# EAGLE design piezo-jfet-buffer-simple-4x (EAGLE 7.2.0)
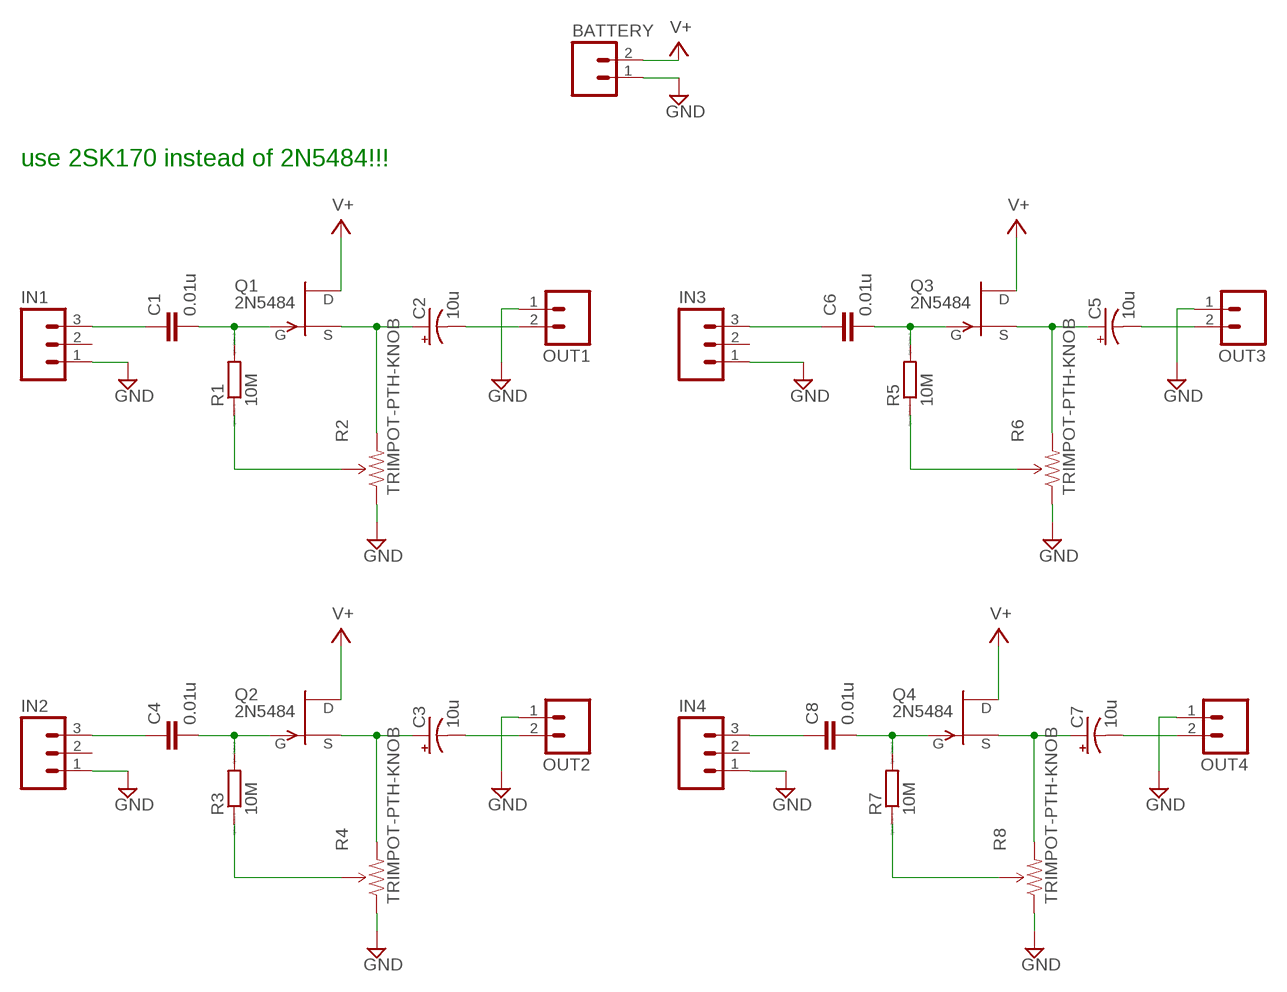
[diagram p0: schematic, sheet 1]

## Parts
BATTERY  M02PTH  [1X02]
C1  0.01u  C5/3  [C5B3]
C2  10u  CAP_POLPTH2  [CPOL-RADIAL-10UF-25V]
C3  10u  CAP_POLPTH2  [CPOL-RADIAL-10UF-25V]
C4  0.01u  C5/3  [C5B3]
C5  10u  CAP_POLPTH2  [CPOL-RADIAL-10UF-25V]
C6  0.01u  C5/3  [C5B3]
C7  10u  CAP_POLPTH2  [CPOL-RADIAL-10UF-25V]
C8  0.01u  C5/3  [C5B3]
IN1  M03LOCK  [1X03_LOCK]
IN2  M03LOCK  [1X03_LOCK]
IN3  M03LOCK  [1X03_LOCK]
IN4  M03LOCK  [1X03_LOCK]
OUT1  M02LOCK  [1X02_LOCK]
OUT2  M02LOCK  [1X02_LOCK]
OUT3  M02LOCK  [1X02_LOCK]
OUT4  M02LOCK  [1X02_LOCK]
Q1  2N5484  [TO92-]
Q2  2N5484  [TO92-]
Q3  2N5484  [TO92-]
Q4  2N5484  [TO92-]
R1  10M  R0204/7  [0204/7]
R2  TRIMPOT-PTH-KNOB  [3386U]
R3  10M  R0204/7  [0204/7]
R4  TRIMPOT-PTH-KNOB  [3386U]
R5  10M  R0204/7  [0204/7]
R6  TRIMPOT-PTH-KNOB  [3386U]
R7  10M  R0204/7  [0204/7]
R8  TRIMPOT-PTH-KNOB  [3386U]

## Nets
CH1: C2.2(-) OUT1.2
CH2: C3.2(-) OUT2.2
CH3: C5.2(-) OUT3.2
CH4: C7.2(-) OUT4.2
GND: BATTERY.1 IN1.1 IN2.1 IN3.1 IN4.1 OUT1.1 OUT2.1 OUT3.1 OUT4.1 R2.1(CCW) R4.1(CCW) R6.1(CCW) R8.1(CCW)
JFET-GATE: C1.2 Q1.1(G) R1.2
JFET-GATE1: C4.2 Q2.1(G) R3.2
JFET-GATE2: C6.2 Q3.1(G) R5.2
JFET-GATE3: C8.2 Q4.1(G) R7.2
JFET-SOURCE: C2.1(+) Q1.2(S) R2.3(CW)
JFET-SOURCE1: C3.1(+) Q2.2(S) R4.3(CW)
JFET-SOURCE2: C5.1(+) Q3.2(S) R6.3(CW)
JFET-SOURCE3: C7.1(+) Q4.2(S) R8.3(CW)
N$1: C1.1 IN1.3
N$2: C4.1 IN2.3
N$3: R1.1 R2.2(WIPER)
N$4: R3.1 R4.2(WIPER)
N$5: C6.1 IN3.3
N$6: R5.1 R6.2(WIPER)
N$7: C8.1 IN4.3
N$8: R7.1 R8.2(WIPER)
V+: BATTERY.2 Q1.3(D) Q2.3(D) Q3.3(D) Q4.3(D)
Unconnected: IN1.2 IN2.2 IN3.2 IN4.2

## Notes on the sheet
- use 2SK170 instead of 2N5484!!!

## Library data of the parts
BATTERY OUT1-OUT4 = SparkFun-Connectors:M02: Header 2 Standard 2-pin 0.1" header. Use with straight break away headers (SKU : PRT-00116), right angle break away headers (PRT-00553), swiss pins (PRT-00743), machine pins (PRT-00117), and female headers (PRT-00115). Molex polarized connector foot print use with SKU : PRT-08233 with associated crimp pins and housings.
C1 C4 C6 C8 = capacitor-wima:C: CAPACITOR naming: grid - package width
C2 C3 C5 C7 = SparkFun-Passives:CAP_POL: Capacitor Polarized These are standard SMD and PTH capacitors. Normally 10uF, 47uF, and 100uF in electrolytic and tantalum varieties. Always verify the external diameter of the through hole cap, it varies with capacity, voltage, and manufacturer. The EIA devices should be standard.
IN1-IN4 = SparkFun-Connectors:M03: Header 3 Standard 3-pin 0.1" header. Use with straight break away headers (SKU : PRT-00116), right angle break away headers (PRT-00553), swiss pins (PRT-00743), machine pins (PRT-00117), and female headers (PRT-00115). Molex polarized connector foot print use with SKU : PRT-08232 with associated crimp pins and housings.
Q1-Q4 = transistor-fet:?548*: N-Channel JFETs Source: VISHAY 2N5484.pdf Compatible: TO92 2N5245 J304 J305 U310 J308 J309 J310 TO72 2N4416 2N4416A 2N3823 2N4351 3N169 3N170 3N171 MFE3002 TO18 2N3796 2N3797 MFE825 Source: Motorola European Master Guide Pacge 3-59
R1 R3 R5 R7 = eagle-ltspice:R: RESISTOR, European symbol; SPICEMODEL: NONE; SPICEPREFIX: R
R2 R4 R6 R8 = SparkFun-Electromechanical:TRIMPOT: Various small potentiometers for "set-and-forget" applications

## Board
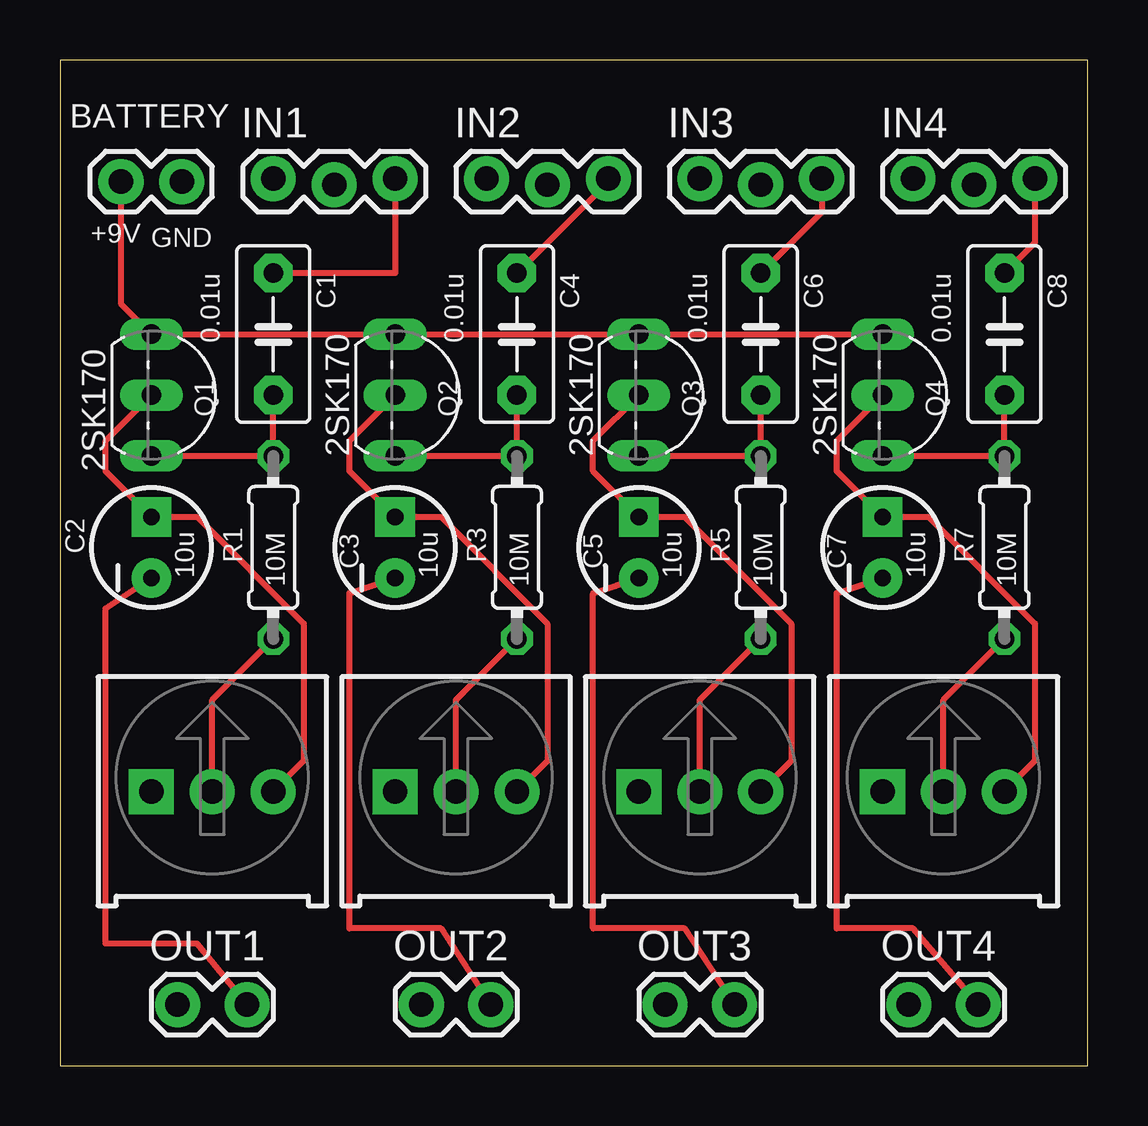
[diagram p1: board, top side]
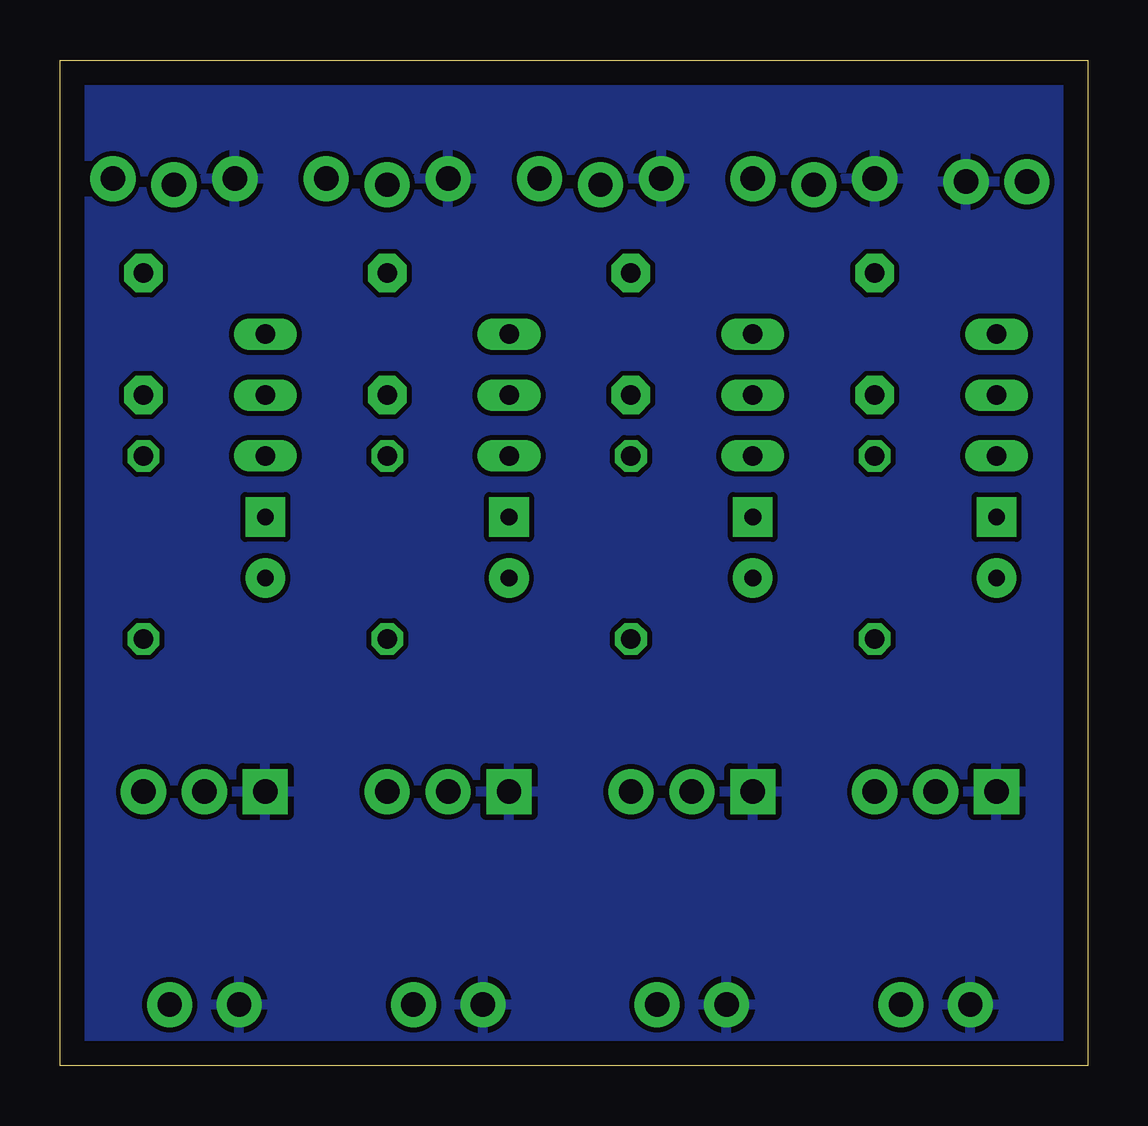
[diagram p2: board, bottom side, seen from below]

Size 42.85 x 41.9 mm. Coordinates in mm from the lower left corner, seen from the top.
Outline: 0,0 42.85,0 42.85,41.9 0,41.9 0,0
Copper layers (1*16): Top 0.035mm / dielectric 1.5mm / Bottom 0.035mm
Design rules "default": minimum track width 10mil, minimum drill 24mil, track to track 8mil, track to pad 8mil, pad to pad 8mil, via to via 8mil, smd to smd 8mil, copper to edge 40mil, drill to drill 8mil, minimum pad ring 10mil, minimum via ring 8mil, stop-mask expansion 4mil, vias tented up to drill 0mil, thermal gap 10mil

### Footprints (pad centres in the part's own frame; a part is rotated, then mirrored left to right if it is on the bottom)
1X02 = drill 1.016 pad 1.88: 1 0,0; 2 2.54,0
C5B3 = drill 0.813 pad 1.6 octagon: 1 -2.54,0; 2 2.54,0
CPOL-RADIAL-10UF-25V = drill 0.7 pad 1.651 square: 1 1.27,0 | drill 0.7 pad 1.651: 2 -1.27,0
1X03_LOCK = drill 1.016 pad 1.88: 1 0,0.127; 2 2.54,-0.127; 3 5.08,0.127
1X02_LOCK = drill 1.016 pad 1.88: 1 -0.178,0; 2 2.718,0
TO92- = drill 0.813 long: 1 2.54,0; 2 0,0; 3 -2.54,0
0204/7 = drill 0.813 octagon: 1 -3.81,0; 2 3.81,0
3386U = drill 1.016 pad 1.88 square: 1 -2.54,-0.015 | drill 1.016 pad 1.88: 2 0,-0.015; 3 2.54,-0.015

### Placement (x,y rotation side)
BATTERY  5.08,36.83 180 top
C1  8.89,30.48 270 top
C2  3.81,21.59 90 top
C3  13.97,21.59 90 top
C4  19.05,30.48 270 top
C5  24.13,21.59 90 top
C6  29.21,30.48 270 top
C7  34.29,21.59 90 top
C8  39.37,30.48 270 top
IN1  8.89,36.83 0 top
IN2  17.78,36.83 0 top
IN3  26.67,36.83 0 top
IN4  35.56,36.83 0 top
OUT1  5.08,2.54 0 top
OUT2  15.24,2.54 0 top
OUT3  25.4,2.54 0 top
OUT4  35.56,2.54 0 top
Q1  3.81,27.94 270 top
Q2  13.97,27.94 270 top
Q3  24.13,27.94 270 top
Q4  34.29,27.94 270 top
R1  8.89,21.59 90 top
R2  6.35,11.43 0 top
R3  19.05,21.59 90 top
R4  16.51,11.43 0 top
R5  29.21,21.59 90 top
R6  26.67,11.43 0 top
R7  39.37,21.59 90 top
R8  36.83,11.43 0 top

### Tracks (layer width: path | path; a pad name or v marks a point on that pad's centre or on a via)
CH1
  Top 0.254: C2.2 1.91,19.05 1.91,5.08 5.71,5.08 OUT1.2
CH2
  Top 0.254: C3.2 12.06,19.68 12.06,5.71 15.88,5.71 OUT2.2
CH3
  Top 0.254: C5.2 22.23,19.68 22.23,5.71 26.04,5.71 OUT3.2
CH4
  Top 0.254: C7.2 32.38,19.68 32.38,5.71 35.56,5.71 OUT4.2
GND
  pour Bottom: 0,41.91 43.18,41.91 43.18,0 0,0
JFET-GATE
  Top 0.254: Q1.1 R1.2 C1.2
JFET-GATE1
  Top 0.254: Q2.1 R3.2 C4.2
JFET-GATE2
  Top 0.254: Q3.1 R5.2 C6.2
JFET-GATE3
  Top 0.254: Q4.1 R7.2 C8.2
JFET-SOURCE
  Top 0.254: Q1.2 1.91,26.04 1.91,24.77 C2.1 5.71,22.86 10.16,18.41 10.16,12.7 8.89,11.43 R2.3
JFET-SOURCE1
  Top 0.254: Q2.2 12.06,26.04 12.06,24.77 C3.1 15.88,22.86 20.32,18.41 20.32,12.7 19.05,11.43 R4.3
JFET-SOURCE2
  Top 0.254: Q3.2 22.23,26.04 22.23,24.77 C5.1 26.04,22.86 30.48,18.41 30.48,12.7 29.21,11.43 R6.3
JFET-SOURCE3
  Top 0.254: Q4.2 32.38,26.04 32.38,24.77 C7.1 36.2,22.86 40.64,18.41 40.64,12.7 39.37,11.43 R8.3
N$1
  Top 0.254: C1.1 13.97,33.02 IN1.3
N$2
  Top 0.254: C4.1 22.86,36.83 IN2.3
N$3
  Top 0.254: R1.1 6.35,15.24 R2.2
N$4
  Top 0.254: R3.1 16.51,15.24 R4.2
N$5
  Top 0.254: C6.1 31.75,35.56 IN3.3
N$6
  Top 0.254: R5.1 26.67,15.24 R6.2
N$7
  Top 0.254: C8.1 40.64,34.29 IN4.3
N$8
  Top 0.254: R7.1 36.83,15.24 R8.2
V+
  Top 0.254: BATTERY.2 2.54,31.75 Q1.3 Q2.3 Q3.3 Q4.3

### Text on the board
tNames: GND | +9V | 2SK170 | 2SK170 | 2SK170 | 2SK170